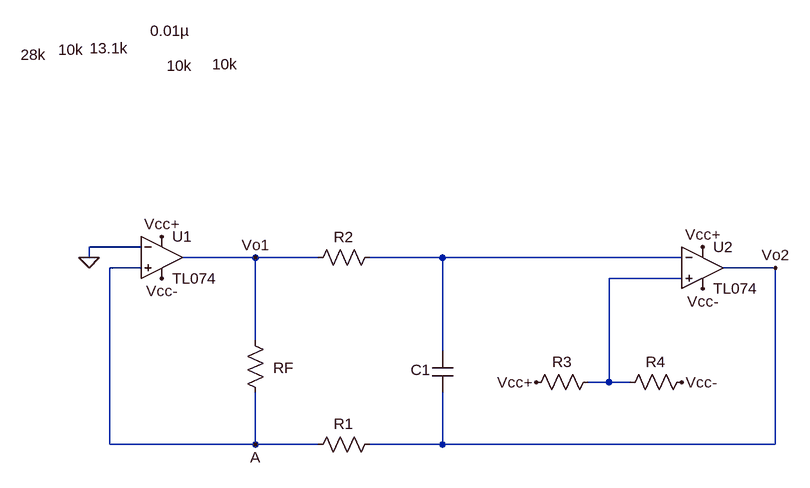
[diagram p0: schematic Esquematico PrimeraEtapa.asc]
Esquematico PrimeraEtapa.asc, the LTspice schematic file:
Version 4
SHEET 1 1012 680
WIRE -208 176 -288 176
WIRE -288 192 -288 176
WIRE -32 192 -144 192
WIRE 64 192 -32 192
WIRE 256 192 144 192
WIRE 624 192 256 192
WIRE -208 208 -256 208
WIRE 768 208 688 208
WIRE 624 224 512 224
WIRE -32 320 -32 192
WIRE 256 336 256 192
WIRE 512 384 512 224
WIRE 512 384 480 384
WIRE 544 384 512 384
WIRE -256 480 -256 208
WIRE -32 480 -32 400
WIRE -32 480 -256 480
WIRE 64 480 -32 480
WIRE 256 480 256 400
WIRE 256 480 144 480
WIRE 768 480 768 208
WIRE 768 480 256 480
FLAG -288 192 0
FLAG 400 384 Vcc+
FLAG 624 384 Vcc-
FLAG -176 160 Vcc+
FLAG -176 224 Vcc-
FLAG 656 176 Vcc+
FLAG 656 240 Vcc-
FLAG -32 480 A
FLAG -32 192 Vo1
FLAG 768 208 Vo2
SYMBOL res -48 304 R0
WINDOW 0 43 58 Left 2
WINDOW 3 -345 -424 Left 2
SYMATTR InstName RF
SYMATTR Value 28k
SYMBOL res 160 176 R90
WINDOW 0 0 56 VBottom 2
WINDOW 3 -322 417 VTop 2
SYMATTR InstName R2
SYMATTR Value 13.1k
SYMBOL res 160 464 R90
WINDOW 0 0 56 VBottom 2
WINDOW 3 -608 476 VTop 2
SYMATTR InstName R1
SYMATTR Value 10k
SYMBOL cap 240 336 R0
WINDOW 0 -33 29 Left 2
WINDOW 3 -434 -493 Left 2
SYMATTR InstName C1
SYMATTR Value 0.01µ
SYMBOL res 496 368 R90
WINDOW 0 0 56 VBottom 2
WINDOW 3 -487 645 VTop 2
SYMATTR InstName R3
SYMATTR Value 10k
SYMBOL res 640 368 R90
WINDOW 0 0 56 VBottom 2
WINDOW 3 -489 719 VTop 2
SYMATTR InstName R4
SYMATTR Value 10k
SYMBOL Opamps/opamp2 -176 128 R0
SYMATTR InstName U1
SYMATTR Value TL074
SYMBOL Opamps/opamp2 656 144 R0
SYMATTR InstName U2
SYMATTR Value TL074

The netlist it stands for:
* Esquematico PrimeraEtapa.asc
RF Vo1 A 28k
R2 N001 Vo1 13.1k
R1 Vo2 A 10k
C1 N001 Vo2 0.01µ
R3 N002 Vcc+ 10k
R4 Vcc- N002 10k
XU1 A 0 Vcc+ Vcc- Vo1 TL074  ; pins In+ In- V+ V- OUT
XU2 N002 N001 Vcc+ Vcc- Vo2 TL074  ; pins In+ In- V+ V- OUT
.backanno
.end